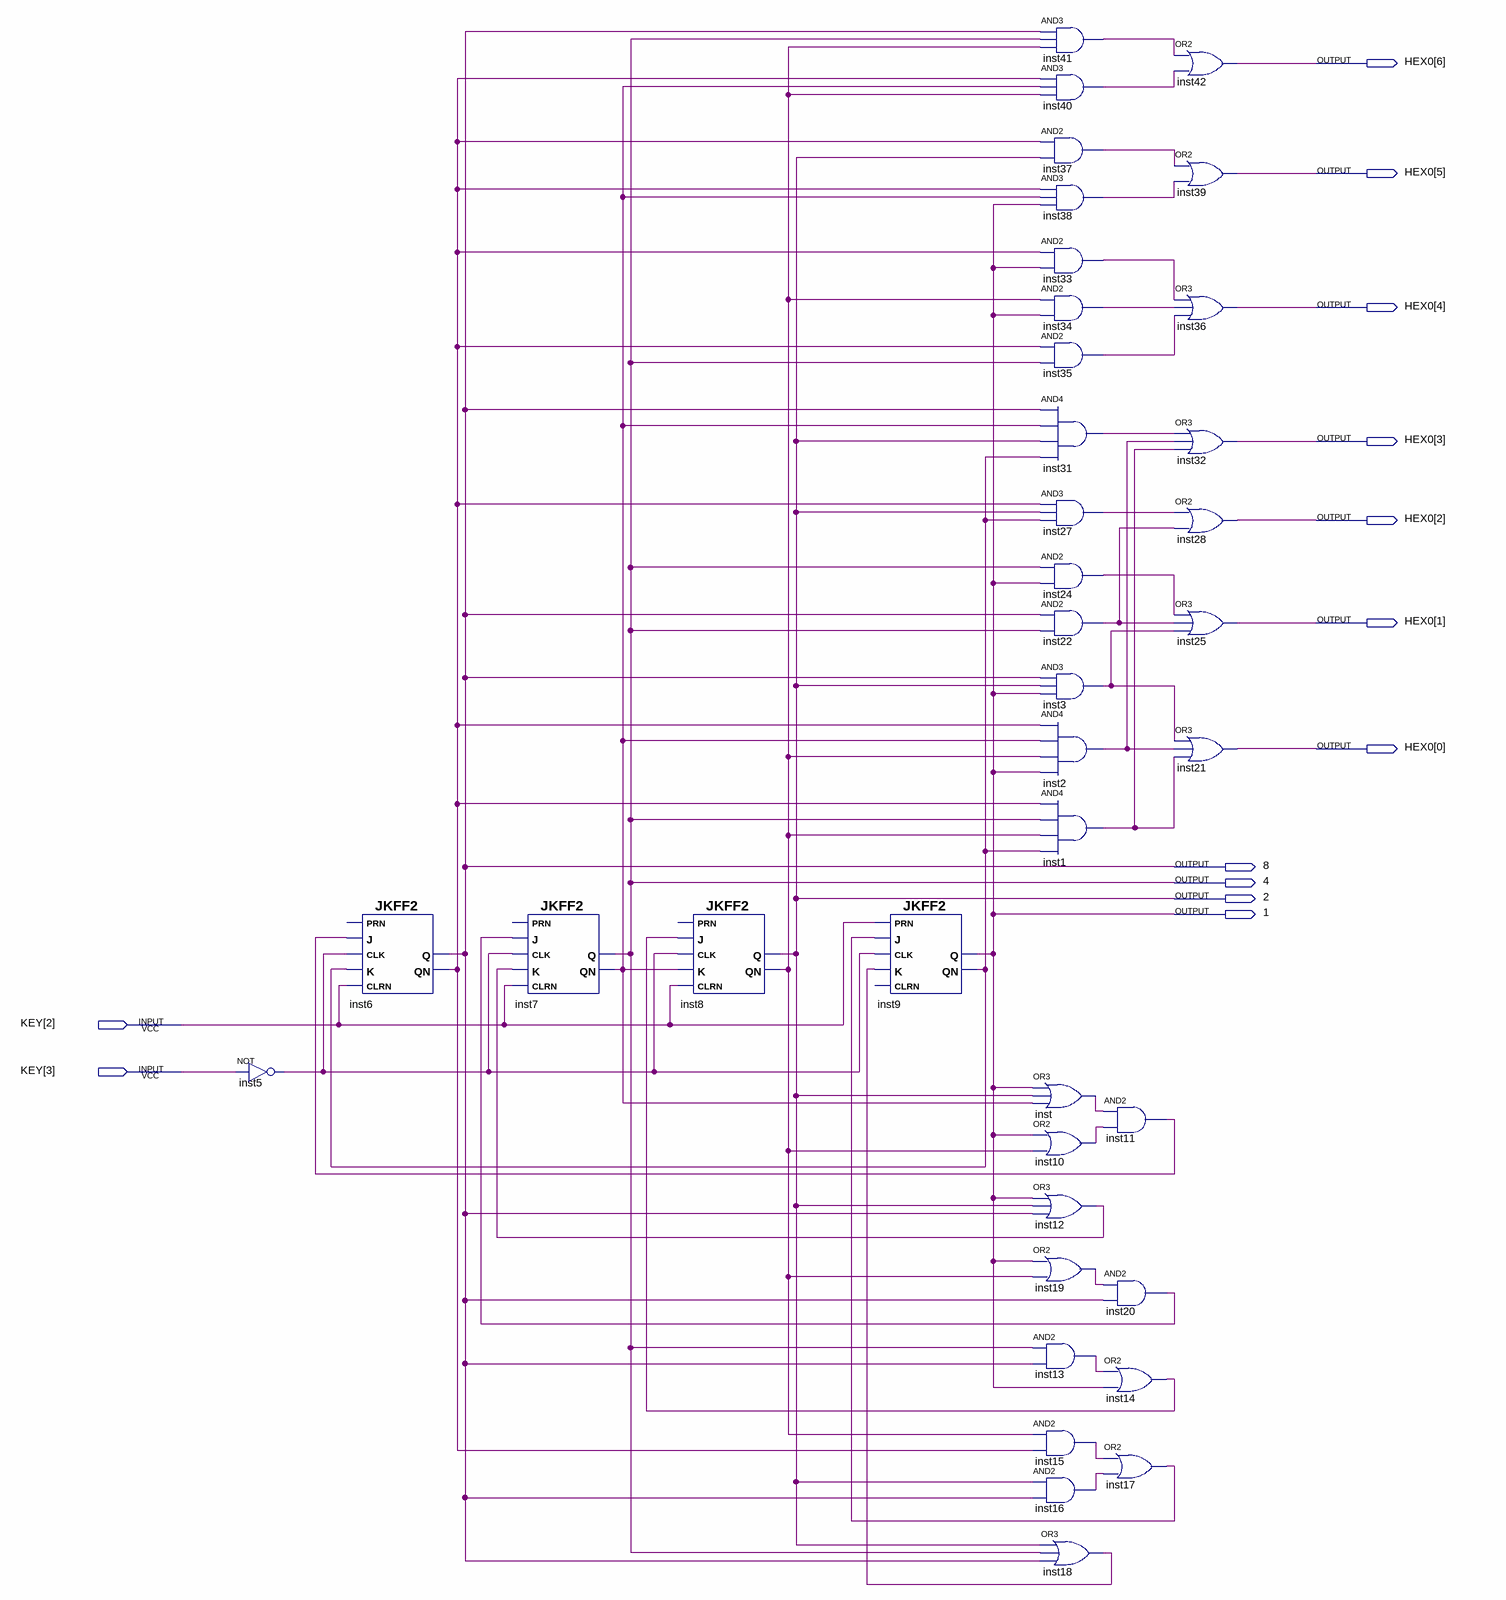
[diagram p0: schematic sheet]
// Quartus schematic jk.bdf as structural Verilog: 38 symbols, 13 pins
module jk (
  input  [3:2] KEY,
  output [6:0] HEX0,
  output \8 ,
  output \4 ,
  output \2 ,
  output \1 
);

  wire inst1_out, inst2_out, inst3_out, inst5_out, inst6_qn, inst7_qn, inst8_qn, inst9_qn, inst10_out,
       inst11_out, inst12_out, inst13_out, inst14_out, inst15_out, inst16_out, inst17_out, inst18_out,
       inst19_out, inst20_out, inst22_out, inst24_out, inst27_out, inst31_out, inst33_out, inst34_out,
       inst35_out, inst37_out, inst38_out, inst40_out, inst41_out, inst_out;

  not inst5 (inst5_out, KEY[3]);
  JKFF2 inst6 (.K(inst9_qn), .CLRN(KEY[2]), .CLK(inst5_out), .J(inst11_out), .QN(inst6_qn), .Q(\8 ));  // open: PRN
  JKFF2 inst7 (.K(inst12_out), .CLRN(KEY[2]), .CLK(inst5_out), .J(inst20_out), .QN(inst7_qn), .Q(\4 ));  // open: PRN
  JKFF2 inst8 (.K(inst7_qn), .CLRN(KEY[2]), .CLK(inst5_out), .J(inst14_out), .QN(inst8_qn), .Q(\2 ));  // open: PRN
  JKFF2 inst9 (.K(inst18_out), .CLK(inst5_out), .PRN(KEY[2]), .J(inst17_out), .QN(inst9_qn), .Q(\1 ));  // open: CLRN
  and inst41 (inst41_out, \8 , \4 , inst8_qn);
  and inst40 (inst40_out, inst6_qn, inst7_qn, inst8_qn);
  and inst37 (inst37_out, inst6_qn, \2 );
  and inst38 (inst38_out, inst6_qn, inst7_qn, \1 );
  and inst33 (inst33_out, inst6_qn, \1 );
  and inst34 (inst34_out, inst8_qn, \1 );
  and inst35 (inst35_out, inst6_qn, \4 );
  and inst31 (inst31_out, \8 , inst7_qn, \2 , inst9_qn);
  and inst27 (inst27_out, inst6_qn, \2 , inst9_qn);
  and inst24 (inst24_out, \4 , \1 );
  and inst22 (inst22_out, \8 , \4 );
  and inst3 (inst3_out, \8 , \2 , \1 );
  and inst2 (inst2_out, inst6_qn, inst7_qn, inst8_qn, \1 );
  and inst1 (inst1_out, inst6_qn, \4 , inst8_qn, inst9_qn);
  or inst (inst_out, \1 , \2 , inst7_qn);
  or inst10 (inst10_out, \1 , inst8_qn);
  or inst12 (inst12_out, \1 , \2 , \8 );
  or inst19 (inst19_out, \1 , inst8_qn);
  and inst13 (inst13_out, \4 , \8 );
  and inst15 (inst15_out, inst8_qn, inst6_qn);
  and inst16 (inst16_out, \2 , \8 );
  or inst18 (inst18_out, \2 , \4 , \8 );
  and inst11 (inst11_out, inst_out, inst10_out);
  and inst20 (inst20_out, inst19_out, \8 );
  or inst14 (inst14_out, inst13_out, \1 );
  or inst17 (inst17_out, inst15_out, inst16_out);
  or inst42 (HEX0[6], inst41_out, inst40_out);
  or inst39 (HEX0[5], inst37_out, inst38_out);
  or inst36 (HEX0[4], inst33_out, inst34_out, inst35_out);
  or inst32 (HEX0[3], inst31_out, inst2_out, inst1_out);
  or inst28 (HEX0[2], inst27_out, inst22_out);
  or inst25 (HEX0[1], inst24_out, inst22_out, inst3_out);
  or inst21 (HEX0[0], inst3_out, inst2_out, inst1_out);
endmodule
